# EAGLE schematic lcd16x2PYRO (EAGLE 6.1)
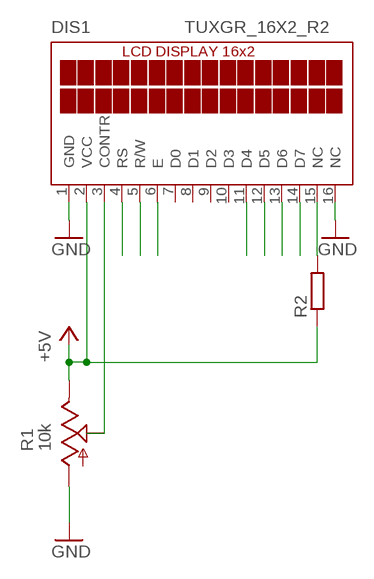
[diagram p0: schematic, sheet 1]

## Parts
DIS1  TUXGR_16X2_R2  [TUXGR_16X2_R2]
R1  10k  TRIM_US-CA6V  [CA6V]
R2  R-EU_0204/7  [0204/7]

## Nets
+5V: DIS1.2(VCC) R1.E R2.1
GND: DIS1.1(GND) DIS1.16(NC) R1.A
N$1: DIS1.3(CONTR)
N$3: DIS1.15(NC) R2.2
N$4: DIS1.4(RS)
N$5: DIS1.5(R/W)
N$6: DIS1.6(E)
N$7: DIS1.14(D7)
N$8: DIS1.13(D6)
N$9: DIS1.12(D5)
N$10: DIS1.11(D4)
Unconnected: DIS1.7(D0) DIS1.8(D1) DIS1.9(D2) DIS1.10(D3) R1.S

## Library data of the parts
DIS1 = display-lcd:TUXGR_16X2_R2: Tuxgraphics LCD display 16x2 characters reflective, without background light Source: tuxgr_12x2_r2.pdf; OC_FARNELL: unknown; OC_NEWARK: unknown
R1 = pot:TRIM_US-: POTENTIOMETER
R2 = resistor:R-EU_: RESISTOR, European symbol